# Altium schematic sheet Hall Effect.SchDoc
size A; SheetNumber: 7; SheetTotal: 10
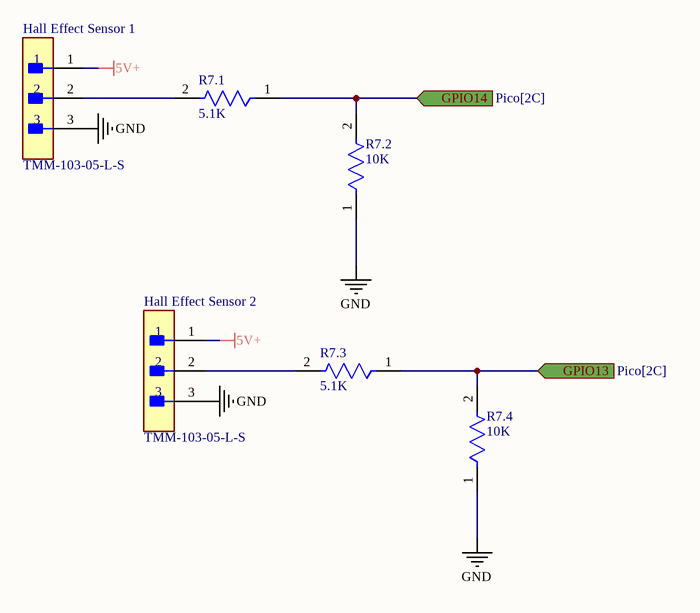
[diagram p0: Hall Effect.SchDoc]

## Parts
Hall_Effect_Sensor_1  TMM-103-05-L-S  [FP-TMM-103-05-L-S-MFG]
Hall_Effect_Sensor_2  TMM-103-05-L-S  [FP-TMM-103-05-L-S-MFG]
R7.1  5.1K  [FP-MFR-12-MFG]
R7.2  10K  [FP-MFR-12-MFG]
R7.3  5.1K  [FP-MFR-12-MFG]
R7.4  10K  [FP-MFR-12-MFG]

## Ports
GPIO13 (in, see Pico[2C]), GPIO14 (in, see Pico[2C])

## Nets
5V+: Hall_Effect_Sensor_1.1 Hall_Effect_Sensor_2.1
GND: Hall_Effect_Sensor_1.3 Hall_Effect_Sensor_2.3 R7.2.1 R7.4.1
GPIO13: R7.3.1 R7.4.2 ; port GPIO13
GPIO14: R7.1.1 R7.2.2 ; port GPIO14
NetHall_Effect_Sensor_1_2: Hall_Effect_Sensor_1.2 R7.1.2
NetHall_Effect_Sensor_2_2: Hall_Effect_Sensor_2.2 R7.3.2

## Library data of the parts
Hall_Effect_Sensor_1 Hall_Effect_Sensor_2 = CMP-02766-001628-1: 2MM TERMINAL STRIP; Number of Positions: 3; Connector Type: Header; Gender: Male; Mount: Through Hole; Contact Finish - Mating: GOLD; Series: TMM; Insulation Color: Black; Contact Plating: Gold; Contact Material: Bronze; Radiation Hardening: No; Contact Type: Male Pin; Fastening Type: Pull; Number of Contacts: 3; Contact Shape: Square; Termination: Solder; Max Operating Temperature: 125°C; Pitch: 2mm; Number of Rows: 1; Min Operating Temperature: -55°C; Insulation Material: Polymer; Lead Free: Lead Free; RoHS Compliant: Yes; Packaging: Bulk
R7.1-R7.4 = CMP-03413-000012-1: RES MF 1/6W 1% AXIAL; Power Rating: 160mW; Voltage Rating (DC): 200V; Resistance: 10kR; Min Operating Temperature: -55°C; Max Operating Temperature: 155°C; Voltage Rating: 200V; Termination: Axial; Packaging: Ammo Pack; Tolerance: 1%